# Altium schematic sheet Copy of ST_LINK_V2-1.SCHDOC: STLINK/V2-1
size A4; DocumentNumber: MB1137; Revision: B-01; SheetNumber: 3; SheetTotal: 6; Project: NUCLEO-XXXXZX
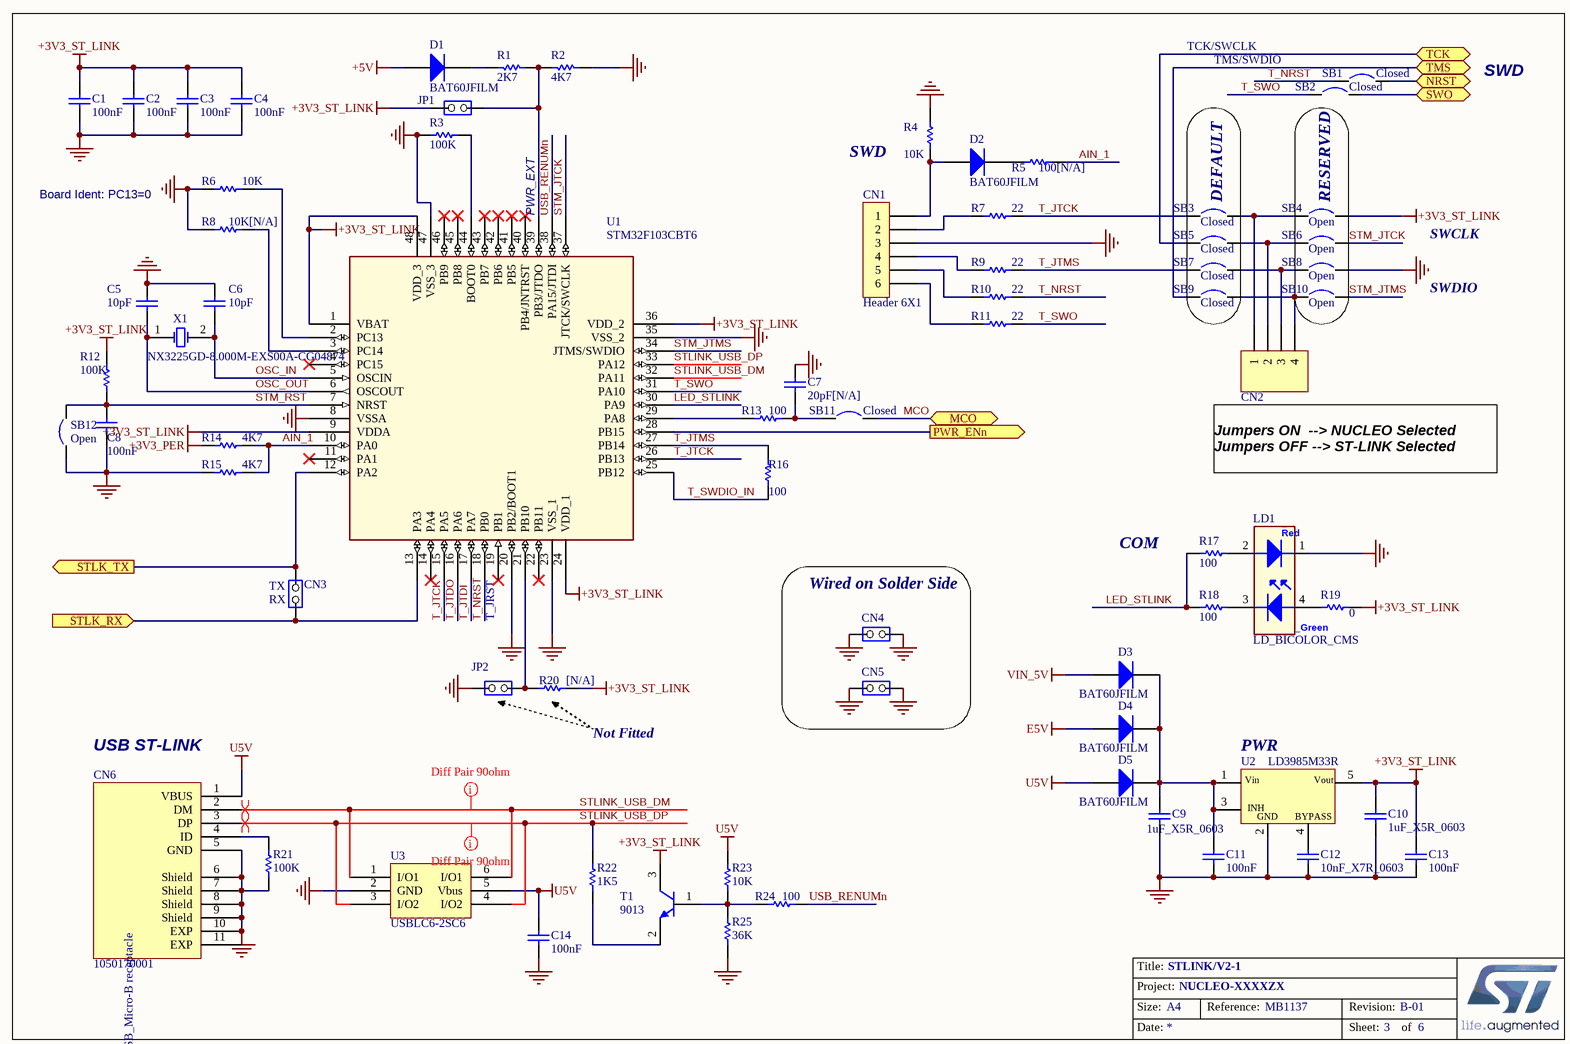
[diagram p0: Copy of ST_LINK_V2-1.SCHDOC]

## Parts
C1  100nF  [0603C]
C2  100nF  [0603C]
C3  100nF  [0603C]
C4  100nF  [0603C]
C5  10pF  [0603C]
C6  10pF  [0603C]
C7  20pF[N/A]  [0603C]
C8  100nF  [0603C]
C9  1uF_X5R_0603  [0603C]
C10  1uF_X5R_0603  [0603C]
C11  100nF  [0603C]
C12  10nF_X7R_0603  [0603C]
C13  100nF  [0603C]
C14  100nF  [0603C]
CN1  Header 6X1  [HDR_1x6_2R54_V_M]
CN2  Header 4  [HDR_1x4_2R54_V_M]  (value not drawn)
CN3  (no value)  [HDR_1x2_2R54_V_M_S]
CN4  (no value)  [HDR_1x2_2R54_V_M]
CN5  (no value)  [HDR_1x2_2R54_V_M]
CN6  1050170001  [Molex_1050170001]
D1  BAT60JFILM  [SOD-323]
D2  BAT60JFILM  [SOD-323]
D3  BAT60JFILM  [SOD-323]
D4  BAT60JFILM  [SOD-323]
D5  BAT60JFILM  [SOD-323]
JP1  (no value)  [HDR_1x2_2R54_V_M_S]
JP2  (no value)  [HDR_1x2_2R54_V_M_S]
LD1  LD_BICOLOR_CMS  [HSMF-A201]
R1  2K7  [0603R]
R2  4K7  [0603R]
R3  100K  [0603R]
R4  10K  [0603R]
R5  100[N/A]  [0603R]
R6  10K  [0603R]
R7  22  [0603R]
R8  10K[N/A]  [0603R]
R9  22  [0603R]
R10  22  [0603R]
R11  22  [0603R]
R12  100K  [0603R]
R13  100  [0603R]
R14  4K7  [0603R]
R15  4K7  [0603R]
R16  100  [0603R]
R17  100  [0603R]
R18  100  [0603R]
R19  0  [0603R]
R20  [N/A]  [0603R]
R21  100K  [0603R]
R22  1K5  [0603R]
R23  10K  [0603R]
R24  100  [0603R]
R25  36K  [0603R]
SB1  Closed  [SB_0603]
SB2  Closed  [SB_0603]
SB3  Closed  [SB_0603]
SB4  Open  [SB_0603]
SB5  Closed  [SB_0603]
SB6  Open  [SB_0603]
SB7  Closed  [SB_0603]
SB8  Open  [SB_0603]
SB9  Closed  [SB_0603]
SB10  Open  [SB_0603]
SB11  Closed  [SB_0603]
SB12  Open  [SB_0603]
T1  9013  [SOT-23]
U1  STM32F103CBT6  [LQFP48_0R5_7x7]
U2  LD3985M33R  [SOT-23-5L]
U3  USBLC6-2SC6  [SOT23-6L]
X1  NX3225GD-8.000M-EXS00A-CG04874  [OSC_2SM_3R2x2R5]

## Blocks framed on the sheet
DEFAULT: SB3 SB5 SB7 SB9
RESERVED: SB4 SB6 SB8 SB10
Wired on Solder Side: CN4 CN5

## Ports
MCO, NRST, PWR_ENn (out), STLK_RX (in), STLK_TX (out), SWO, TCK, TMS

## Nets
+3V3_PER: R14.1
+3V3_ST_LINK: C1.2 C2.2 C3.2 C4.2 C10.1 C13.2 JP1.1(COMMON) R12.2 R19.2 R20.1 SB4.2 T1.3(C) U1.1(VBAT) U1.9(VDDA) U1.24(VDD_1) U1.36(VDD_2) U1.48(VDD_3) U2.5(Vout)
+5V: D1.1(A)
E5V: D4.1(A)
GND: C1.1 C2.1 C3.1 C4.1 C5.2 C6.2 C7.2 C8.1 C9.1 C10.2 C11.1 C12.1 C13.1 C14.1 CN1.3 CN4.1(COMMON) CN4.2(NO) CN5.1(COMMON) CN5.2(NO) CN6.5(GND) CN6.6(Shield) CN6.7(Shield) CN6.8(Shield) CN6.9(Shield) CN6.10(EXP) JP2.1(COMMON) LD1.1 R2.2 R3.1 R4.2 R6.1 R8.1 R15.1 R21.2 R25.1 SB8.2 SB12.1 U1.8(VSSA) U1.20(PB2/BOOT1) U1.23(VSS_1) U1.35(VSS_2) U1.47(VSS_3) U2.2(GND) U3.2(GND)
U5V: C14.2 CN6.1(VBUS) D5.1(A) R23.2 U3.5(Vbus)
VIN_5V: D3.1(A)
AIN_1: R5.2 R14.2 R15.2 U1.10(PA0)
LED_STLINK: R17.1 R18.1 U1.30(PA9)
MCO: SB11.2 ; port MCO
NRST: SB1.2 ; port NRST
OSC_IN: C6.1 U1.5(OSCIN) X1.2(OSC2)
OSC_OUT: C5.1 U1.6(OSCOUT) X1.1(OSC1)
PWR_ENn: U1.28(PB15) ; port PWR_ENn
STLINK_USB_DM: CN6.2(DM) U1.32(PA11) U3.1(I/O1) U3.6(I/O1)
STLINK_USB_DP: CN6.3(DP) R22.1 U1.33(PA12) U3.3(I/O2) U3.4(I/O2)
STLK_RX: CN3.1(COMMON) U1.13(PA3) ; port STLK_RX
STLK_TX: CN3.2(NO) U1.12(PA2) ; port STLK_TX
STM_JTCK: SB6.2 U1.37(JTCK/SWCLK)
STM_JTMS: SB10.2 U1.34(JTMS/SWDIO)
STM_RST: C8.2 R12.1 SB12.2 U1.7(NRST)
SWO: SB2.2 ; port SWO
T_JTCK: R7.2 SB3.1 U1.15(PA5) U1.26(PB13)
T_JTDI: U1.17(PA7)
T_JTDO: U1.16(PA6)
T_JTMS: R9.2 R16.2 SB7.1 U1.27(PB14)
T_NRST: R10.2 SB1.1 U1.18(PB0)
T_SWDIO_IN: R16.1 U1.25(PB12)
T_SWO: R11.2 SB2.1 U1.31(PA10)
TCK: SB5.1 ; port TCK
TMS: SB9.1 ; port TMS
USB_RENUMn: R24.2 U1.38(PA15/JTDI)
NetC7_1: C7.1 R13.2 SB11.1
NetC9_2: C9.2 C11.2 D3.2(K) D4.2(K) D5.2(K) U2.1(Vin) U2.3(CE)
NetC12_2: C12.2 U2.4(BYPASS)
NetCN1_1: CN1.1 D2.1(A) R4.1
NetCN1_2: CN1.2 R7.1
NetCN1_4: CN1.4 R9.1
NetCN1_5: CN1.5 R10.1
NetCN1_6: CN1.6 R11.1
NetCN2_1: CN2.1 SB3.2 SB4.1
NetCN2_2: CN2.2 SB5.2 SB6.1
NetCN2_3: CN2.3 SB7.2 SB8.1
NetCN2_4: CN2.4 SB9.2 SB10.1
NetCN6_4: CN6.4(ID) R21.1
NetD1_2: D1.2(K) R1.1
NetD2_2: D2.2(K) R5.1
NetJP1_2: JP1.2(NO) R1.2 R2.1 U1.39(PB3/JTDO)
NetJP2_2: JP2.2(NO) R20.2 U1.21(PB10)
NetLD1_2: LD1.2 R17.2
NetLD1_3: LD1.3 R18.2
NetLD1_4: LD1.4 R19.1
NetR3_2: R3.2 U1.44(BOOT0)
NetR6_2: R6.2 U1.2(PC13)
NetR8_2: R8.2 U1.3(PC14)
NetR13_1: R13.1 U1.29(PA8)
NetR22_2: R22.2 T1.2(E)
NetR23_1: R23.1 R24.1 R25.2 T1.1(B)

Not connected (* = marked no-connect by the designer): CN6 11(EXP); U1 4(PC15)* 11(PA1)* 14(PA4)* 19(PB1)* 22(PB11)* 40(PB4/JNTRST)* 41(PB5)* 42(PB6)* 43(PB7)* 45(PB8)* 46(PB9)*

## Layout directives
differential pair: (no net found under the mark)
mark named Diff Pair 90ohm: STLINK_USB_DM, STLINK_USB_DP

## Notes on the sheet
- TCK/SWCLK
- TMS/SWDIO
- SWD
- Board Ident: PC13=0
- (near U1) PWR_EXT
- SWCLK
- SWDIO
- Jumpers ON  --> NUCLEO Selected
  Jumpers OFF --> ST-LINK Selected
- (near CN3) TX
- COM
- (near CN3) RX
- T_JRST
- (near CN6) USB ST-LINK
- (near R20) Not Fitted
- (near U2) PWR
- Title:
- Project:
- Size:
- Date:
- A4
- Reference:
- Sheet:
- Revision:
- of
- (in symbol 1050170001) USB_Micro-B receptacle
- (in symbol LD3985M33R) INH
- (in symbol LD_BICOLOR_CMS) Red; _Green

## Library data of the parts
C1-C4 C8 C11 C13 C14 = Capacitor_ST: Capacitor 0402 / 0603 / 0805; Revision: July-2002: Re-released for DXP Platform.; Value: 100nF
C5-C7 = Capacitor_ST: Capacitor 0402 / 0603 / 0805; Value: 100nF; Revision: July-2002: Re-released for DXP Platform.
C9 C10 = CAP SMD 0603  X5R 1µF 25V 10%: 0603  X5R 1µF; Rated voltage: 25V; Tolerance: 10%; Manufacturer: *; Manufacturer P/N: *; Order code Farnell: 1288202RL; Value: 1µF; Power: *; Technology: X5R; Temperature  Factor: *; Temperature Max: +125°C; Temperature Min: -55°C; STS Code: *
C12 = CAP SMD 0603  X7R 10000PF 50V 10%: 0603  X7R 10NF; Order code RS: 2040779; Rated voltage: 50V; Tolerance: 10%; Order code Farnell: 7569548RL; Value: 10NF; Power: *; Technology: X7R; Temperature Factor: *; Temperature Min: -55°C; Temperature Max: +125°C; STS Code: *
CN1 = Header 6X1: Header, 6-Pin, Single row; LatestRevisionDate: 17-Jul-2002; LatestRevisionNote: Re-released for DXP Platform.; Publisher: Altium Limited
CN2 = Header 4: Header, 4-Pin, Single row; Revision: 17-Jul-2002: Re-released for DXP Platform.; Publisher: Altium Limited
CN3 = JP2: Fitted: NO
CN4 CN5 JP1 JP2 = JP2
CN6 = 1050170001: Silkscreen: USB
D1 = Diode: Default Diode; Code - JEDEC: DO-214-AB; Ordered by: STM; ECCN_US/EU: EAR99/NEC; Published: 8-Jun-2000; Revision: July-2002: Re-released for DXP Platform.; Publisher: Altium Limited
D2-D5 = BAT60JFILM: Manuf_1: STM; Provided: ST; ECCN_US/EU: EAR99/NEC; Revision: July-2002: Re-released for DXP Platform.; Order: BAT60JFILM; Manuf_Part_1: BAT60JFILM; Distrib: ST
LD1 = LD_BICOLOR_CMS: Bicolor Led; Manuf_Part_1: HSMF-A201-A00J1; Manuf_1: Avago Technologies; Ref St: xxxxxx; cap_dec: ----; Distrib: RADIOSPARES
R1 R2 R20 R23 R25 = Res1: Resistor; Value: 1K; Published: 8-Jun-2000; Revision: July-2002: Re-released for DXP Platform.; Publisher: Altium Limited
R3 R5 R7 R9-R13 R16-R19 R21 R22 R24 = Resistor_ST: Resistor 0402 / 0603 / 0805; Value: 10K
R4 R6 = Resistor_ST: Resistor 0402 / 0603 / 0805; Value: 10K
R8 R14 R15 = Resistor_ST: Resistor 0402 / 0603 / 0805; Value: 10K; Fitted: NO
SB1-SB3 SB5 SB7 SB9 SB11 = Circuit Breaker_close: Circuit Breaker; Published: 24-Mar-1999; Revision: July-2002: Re-released for DXP Platform.; Publisher: Altium Limited
SB4 SB6 SB8 SB10 SB12 = Circuit Breaker: Published: 24-Mar-1999; Revision: July-2002: Re-released for DXP Platform.; Publisher: Altium Limited
T1 = NPN: NPN Bipolar Transistor; Code - JEDEC: TO-226-AA; Published: 8-Jun-2000; Revision: July-2002: Re-released for DXP Platform.; Publisher: Altium Limited
U1 = STM32F103CBT6: Medium-density performance line ARM-based 32-bit MCU with 64KB Flash; Manuf_Part_1: STM32F103C8T6; Manuf_1: STM; Ref St: 9175981; Provided: ST; ECCN_US/EU: 3A991A2/NEC; Footprint: QFP48 7X7; Distrib: ST; Order: STM32F103C8T6
U2 = LD3985M33R: Ultra low drop-low noise BiCMOS voltage, regulators low ESR capacitors compatible; Manuf_1: STM; Provided: ST; Ref St: 9176161; ECCN_US/EU: EAR99/NEC; Manuf_Part_1: LD3985M33R; Distrib: ST; Order: LD3985M33R
X1 = XTAL: Crystal Oscillator; Published: 8-Jun-2000; LatestRevisionDate: 17-Jul-2002; LatestRevisionNote: Re-released for DXP Platform.; PackageReference: R38; Publisher: Altium Limited